# EAGLE design OpenEVSE_PLUS_v3 (EAGLE 7.1.0)
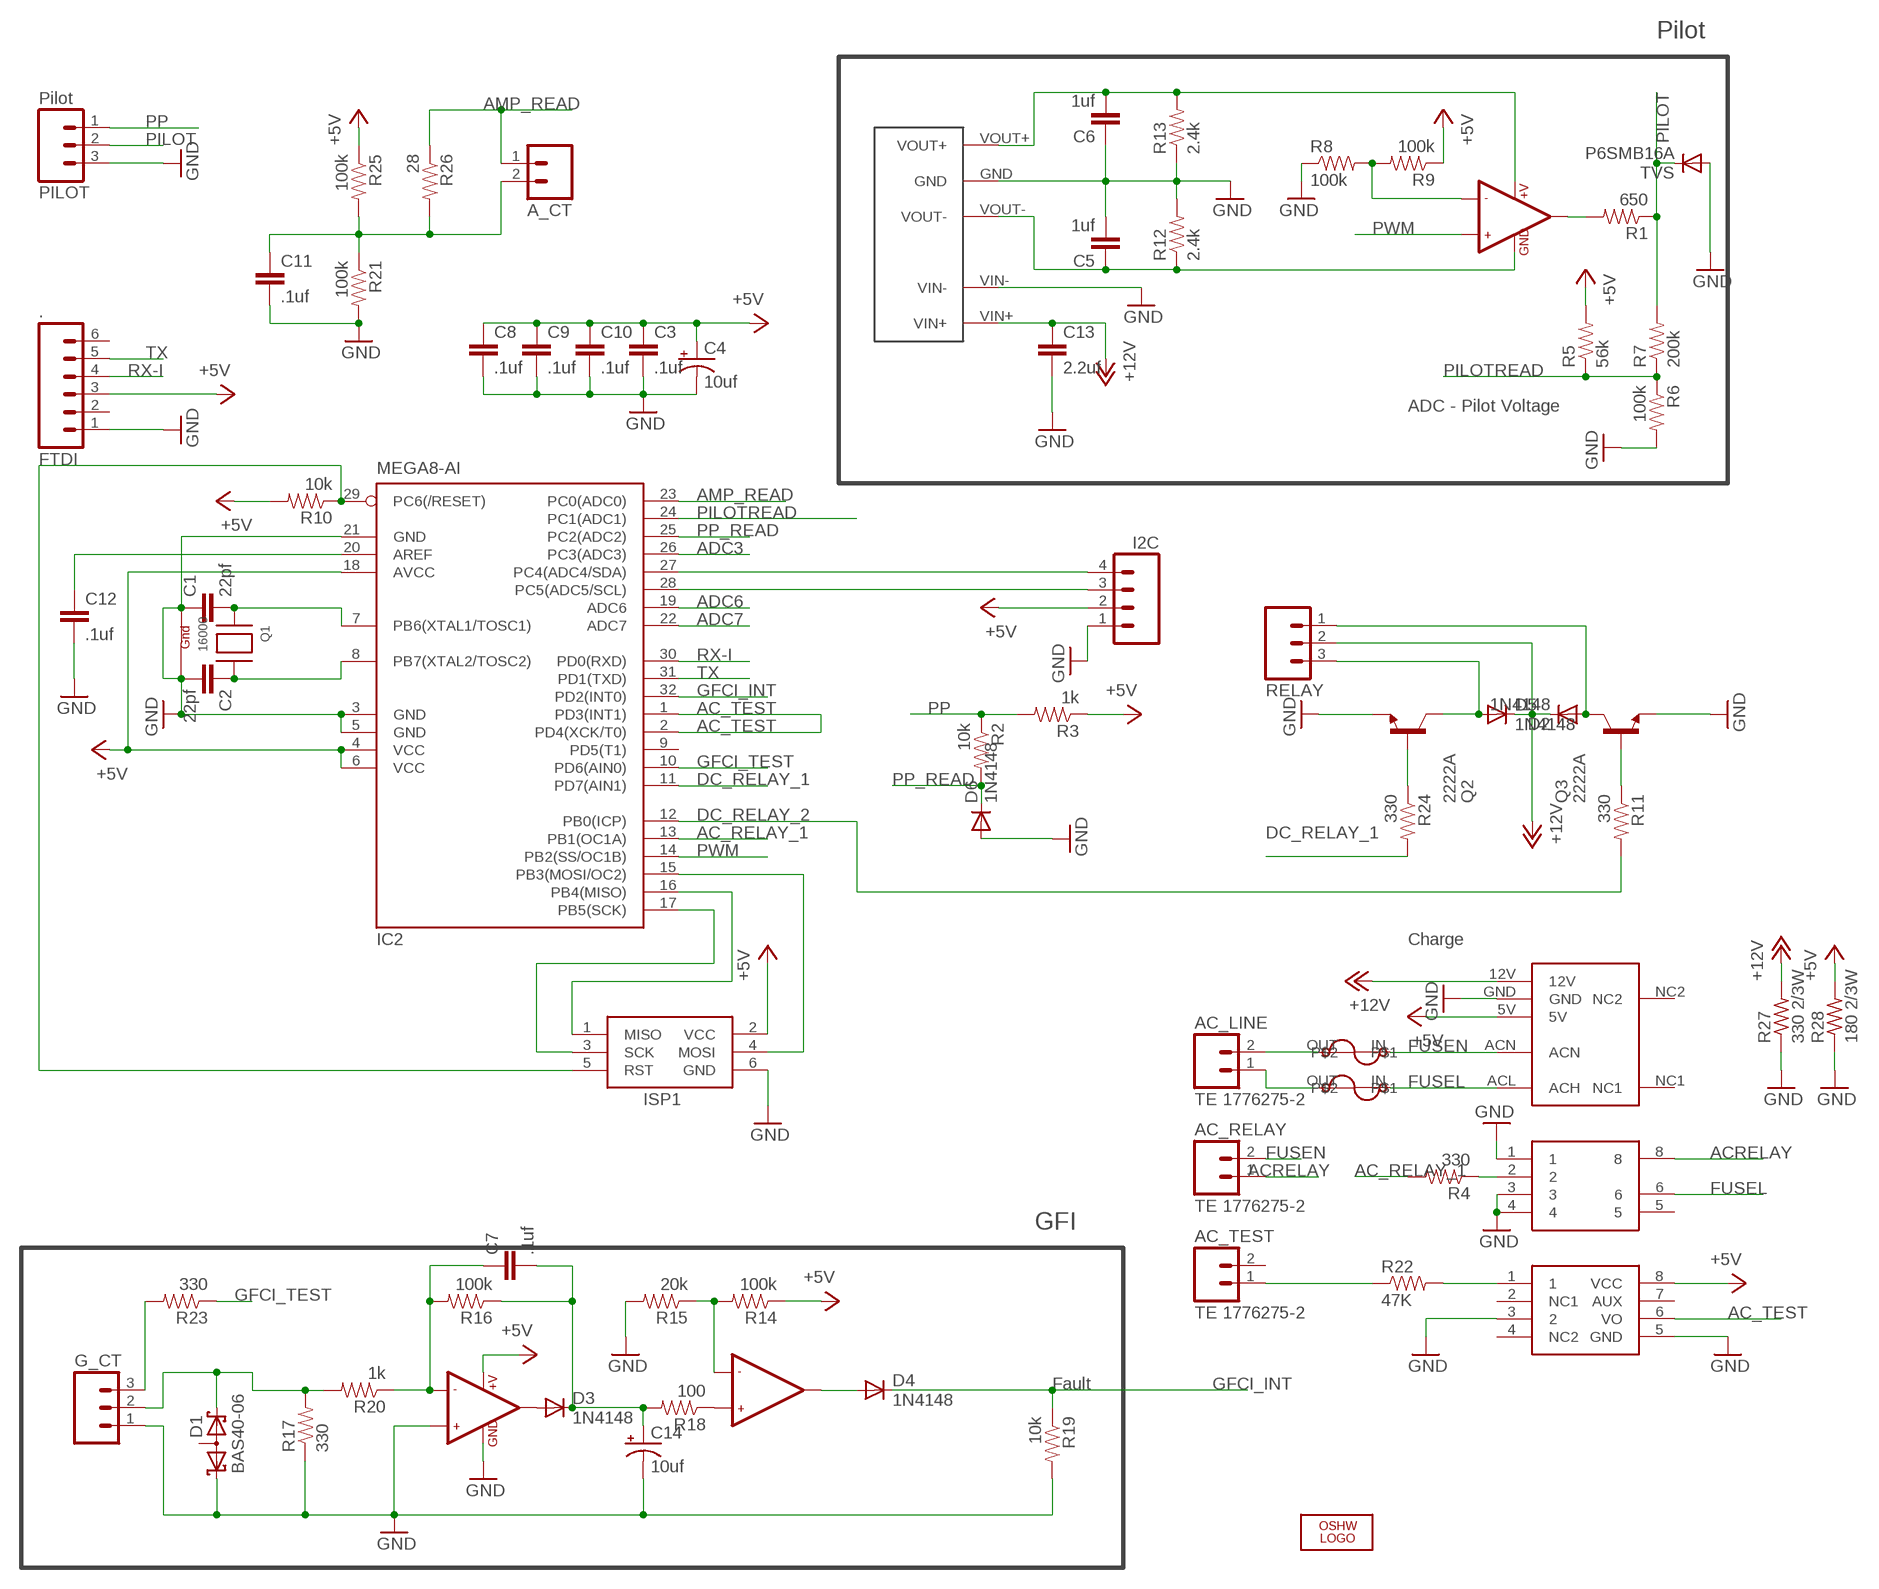
[diagram p0: schematic, sheet 1]

## Parts
.  FTDI  M06LOCK  [1X06_LOCK]
A_CT  M02PTH  [1X02]
AC_LINE  TE 1776275-2  M023.5MM_LOCK  [SCREWTERMINAL-3.5MM-2_LOCK]
AC_RELAY  TE 1776275-2  M023.5MM_LOCK  [SCREWTERMINAL-3.5MM-2_LOCK]
AC_TEST  TE 1776275-2  M023.5MM_LOCK  [SCREWTERMINAL-3.5MM-2_LOCK]
C1  22pf  CAP0805  [0805]
C2  22pf  CAP0805  [0805]
C3  .1uf  CAP0805  [0805]
C4  10uf  CAP_POL1206  [EIA3216]
C5  1uf  CAP0805  [0805]
C6  1uf  CAP0805  [0805]
C7  .1uf  CAP0805  [0805]
C8  .1uf  CAP0805  [0805]
C9  .1uf  CAP0805  [0805]
C10  .1uf  CAP0805  [0805]
C11  .1uf  CAP0805  [0805]
C12  .1uf  CAP0805  [0805]
C13  2.2uf  CAP0805  [0805]
C14  10uf  CAP_POL1206  [EIA3216]
D1  BAS40-06  [SOT23]
D2  1N4148  DIODE-SOD123  [SOD123]
D3  1N4148  DIODE-SOD123  [SOD123]
D4  1N4148  DIODE-SOD123  [SOD123]
D5  1N4148  DIODE-SOD123  [SOD123]
D6  1N4148  DIODE-SOD123  [SOD123]
DCDC  D107E  DCDC_SIP  [DCDC_SIP]
F1  BEL1AFUSE  [BELFUSE1A]
F2  BEL1AFUSE  [BELFUSE1A]
G_CT  M03LOCK  [1X03_LOCK]
I2C  M04LOCK  [1X04_LOCK]
IC2  MEGA8-AI  [TQFP32-08]
IC3  LMV358  [SO08]
IC4  LMV358  [SO08]
IC5  AQH1213  [DIP7]
IC6  MID400  [DIP08]
ISP1  AVRISP-6  [AVRISP]
LOGO1  OSHW_LOGO_8MILX0150-NT  [OSHW_8X150_NOTEXT]
PILOT  Pilot  M03SCREW_LOCK  [SCREWTERMINAL-3.5MM-3_LOCK.007S]
Q1  16000  XTAL-4-3225  [NX3225]
Q2  2222A  BCX70SMD  [SOT23]
Q3  2222A  BCX70SMD  [SOT23]
R1  650  RESISTOR0805-RES  [0805]
R2  10k  RESISTOR0805-RES  [0805]
R3  1k  RESISTOR0805-RES  [0805]
R4  330  RESISTOR0805-RES  [0805]
R5  56k  RESISTOR0805-RES  [0805]
R6  100k  RESISTOR0805-RES  [0805]
R7  200k  RESISTOR0805-RES  [0805]
R8  100k  RESISTOR0805-RES  [0805]
R9  100k  RESISTOR0805-RES  [0805]
R10  10k  RESISTOR0805-RES  [0805]
R11  330  RESISTOR0805-RES  [0805]
R12  2.4k  RESISTOR0805-RES  [0805]
R13  2.4k  RESISTOR0805-RES  [0805]
R14  100k  RESISTOR0805-RES  [0805]
R15  20k  RESISTOR0805-RES  [0805]
R16  100k  RESISTOR0805-RES  [0805]
R17  330  RESISTOR0805-RES  [0805]
R18  100  RESISTOR0805-RES  [0805]
R19  10k  RESISTOR0805-RES  [0805]
R20  1k  RESISTOR0805-RES  [0805]
R21  100k  RESISTOR0805-RES  [0805]
R22  47K  RESISTORPTH-1/4W  [AXIAL-0.4]
R23  330  RESISTOR0805-RES  [0805]
R24  330  RESISTOR0805-RES  [0805]
R25  100k  RESISTOR0805-RES  [0805]
R26  28  RESISTOR0805-RES  [0805]
R27  330 2/3W  R-US_R1206  [R1206]
R28  180 2/3W  R-US_R1206  [R1206]
RELAY  M03SCREW_LOCK  [SCREWTERMINAL-3.5MM-3_LOCK.007S]
TVS  P6SMB16A  DIODE-SMB  [SMB]
U$1  MPM-04E-1205  [MPM-04E-1205]

## Nets
12V: C6.2 DCDC.VOUT+ IC4.8(+V) R13.2
+5V: ..3 C3.1 C4.A(+) C8.1 C9.1 C10.1 I2C.2 IC2.4(VCC) IC2.6(VCC) IC2.18(AVCC) IC3.8(+V) IC6.8(VCC) ISP1.2(VCC) R3.1 R5.2 R9.1 R10.2 R14.1 R25.1 R28.2 U$1.5V
+12V: C13.1 D2.C D5.C DCDC.VIN+ R27.2 RELAY.2 U$1.12V
-12V: C5.1 DCDC.VOUT- IC4.4(GND) R12.1
AC_RELAY_1: IC2.13(PB1(OC1A)) R4.2
AC_TEST: IC2.1(PD3(INT1)) IC2.2(PD4(XCK/T0)) IC6.6(VO)
ACRELAY: AC_RELAY.1 IC5.8
ADC3: IC2.26(PC3(ADC3))
ADC6: IC2.19(ADC6)
ADC7: IC2.22(ADC7)
AMP_READ: A_CT.1 IC2.23(PC0(ADC0)) R26.1
DC_RELAY_1: IC2.11(PD7(AIN1)) R24.2
DC_RELAY_2: IC2.12(PB0(ICP)) R11.2
FUSEL: F2.IN IC5.6 U$1.ACL(ACH)
FUSEN: AC_RELAY.2 F1.IN U$1.ACN
GFCI_INT: D4.C IC2.32(PD2(INT0)) R19.1
GFCI_TEST: IC2.10(PD6(AIN0)) R23.1
GND: ..1 C1.1 C2.2 C3.2 C4.C(-) C5.2 C6.1 C8.2 C9.2 C10.2 C11.2 C12.2 C13.2 C14.C(-) D1.1(K1) D6.A DCDC.GND DCDC.VIN- G_CT.1 I2C.1 IC2.3(GND) IC2.5(GND) IC2.21(GND) IC3.3(+IN1) IC3.4(GND) IC5.1 IC5.3 IC5.4 IC6.3 IC6.5(GND) ISP1.6(GND) PILOT.3 Q1.1(G1) Q1.3(G2) Q2.2(E) Q3.2(E) R6.2 R8.1 R12.2 R13.1 R15.2 R17.1 R19.2 R21.2 R27.1 R28.1 TVS.A U$1.GND
N$1: D2.A Q3.3(C) RELAY.1
N$2: Q3.1(B) R11.1
N$4: C1.2 IC2.7(PB6(XTAL1/TOSC1)) Q1.2(X1)
N$5: C2.1 IC2.8(PB7(XTAL2/TOSC2)) Q1.4(X2)
N$6: D5.A Q2.3(C) RELAY.3
N$7: A_CT.2 C11.1 R21.1 R25.2 R26.2
N$8: C7.1 IC3.2(-IN1) R16.2 R20.1
N$10: IC4.2(-IN1) R8.2 R9.2
N$11: IC4.1(OUT1) R1.2
N$12: AC_LINE.1 F2.OUT
N$13: AC_LINE.2 F1.OUT
N$14: IC2.15(PB3(MOSI/OC2)) ISP1.4(MOSI)
N$15: IC2.17(PB5(SCK)) ISP1.3(SCK)
N$16: IC2.16(PB4(MISO)) ISP1.1(MISO)
N$18: IC5.2 R4.1
N$19: IC6.1 R22.P$2
N$20: D1.2(K2) G_CT.2 R17.2 R20.2
N$21: D3.A IC3.1(OUT1)
N$22: G_CT.3 R23.2
N$23: C7.2 C14.A(+) D3.C R16.1 R18.2
N$24: IC3.6(-IN2) R14.2 R15.1
N$25: D4.A IC3.7(OUT2)
N$26: IC3.5(+IN2) R18.1
N$29: AC_TEST.1 R22.P$1
N$30: Q2.1(B) R24.1
N$39: I2C.4 IC2.27(PC4(ADC4/SDA))
N$40: I2C.3 IC2.28(PC5(ADC5/SCL))
N$44: C12.1 IC2.20(AREF)
PILOT: PILOT.2 R1.1 R7.2 TVS.C
PILOTREAD: IC2.24(PC1(ADC1)) R5.1 R6.1 R7.1
PP: PILOT.1 R2.1 R3.2
PP_READ: D6.C IC2.25(PC2(ADC2)) R2.2
PWM: IC2.14(PB2(SS/OC1B)) IC4.3(+IN1)
RST: IC2.29(PC6(/RESET)) ISP1.5(RST) R10.1
RX-I: ..4 IC2.30(PD0(RXD))
TX: ..5 IC2.31(PD1(TXD))
Unconnected: ..2 ..6 AC_TEST.2 D1.3(AA) IC2.9(PD5(T1)) IC4.5(+IN2) IC4.6(-IN2) IC4.7(OUT2) IC5.5 IC6.2(NC1) IC6.4(NC2) IC6.7(AUX) U$1.NC1 U$1.NC2

## Notes on the sheet
- Pilot
- ADC - Pilot Voltage
- Charge
- GFI
- Fault

## Library data of the parts
. = SparkFun:M06: Header 6 Standard 6-pin 0.1" header. Use with straight break away headers (SKU : PRT-00116), right angle break away headers (PRT-00553), swiss pins (PRT-00743), machine pins (PRT-00117), and female headers (PRT-00115). Molex polarized connector foot print use with SKU : PRT-08094 with associated crimp pins and housings. NOTES ON THE VARIANTS LOCK and LOCK_LONGPADS... This footprint was designed to help hold the alignment of a through-hole component (i.e. 6-pin header) while soldering it into place. You may notice that each hole has been shifted either up or down by 0.005 of an inch from it's more standard position (which is a perfectly straight line). This slight alteration caused the pins (the squares in the middle) to touch the edges of the holes. Because they are alternating, it causes a "brace" to hold the component in place. 0.005 has proven to be the perfect amount of "off-center" position when using our standard breakaway headers. Although looks a little odd when you look at the bare footprint, once you have a header in there, the alteration is very hard to notice. Also, if you push a header all the way into place, it is covered up entirely on the bottom side. This idea of altering the position of holes to aid alignment will be further integrated into the Sparkfun Library for other footprints. It can help hold any component with 3 or more connection pins.
A_CT AC_LINE AC_RELAY AC_TEST = SparkFun:M02: Header 2 Standard 2-pin 0.1" header. Use with straight break away headers (SKU : PRT-00116), right angle break away headers (PRT-00553), swiss pins (PRT-00743), machine pins (PRT-00117), and female headers (PRT-00115). Molex polarized connector foot print use with SKU : PRT-08233 with associated crimp pins and housings.
C1-C3 C5-C13 = SparkFun:CAP: Capacitor Standard 0603 ceramic capacitor, and 0.1" leaded capacitor.
C4 C14 = SparkFun:CAP_POL: Capacitor Polarized These are standard SMD and PTH capacitors. Normally 10uF, 47uF, and 100uF in electrolytic and tantalum varieties. Always verify the external diameter of the through hole cap, it varies with capacity, voltage, and manufacturer. The EIA devices should be standard.
D1 = diode:BAS40-06: Silicon Schottky Diodes General-purpose diode for high-speed switching
D2-D6 TVS = diode:DIODE-: DIODE
DCDC = Qxd:DCDC_SIP
F1 F2 = Qxd:BEL1AFUSE
G_CT PILOT RELAY = SparkFun:M03: Header 3 Standard 3-pin 0.1" header. Use with straight break away headers (SKU : PRT-00116), right angle break away headers (PRT-00553), swiss pins (PRT-00743), machine pins (PRT-00117), and female headers (PRT-00115). Molex polarized connector foot print use with SKU : PRT-08232 with associated crimp pins and housings.
I2C = SparkFun:M04: Header 4 Standard 4-pin 0.1" header. Use with straight break away headers (SKU : PRT-00116), right angle break away headers (PRT-00553), swiss pins (PRT-00743), machine pins (PRT-00117), and female headers (PRT-00115). Molex polarized connector foot print use with SKU : PRT-08231 with associated crimp pins and housings.
IC2 = atmel:MEGA8: MICROCONTROLLER 8 Kbytes FLASH, 1 kbytes SRAM, 512 bytes EEPROM, USART, 6-channel 10 bit ADC, 2-channel 8 bit ADC Pin compatible with Atmega48, ATMega88, ATMega168 Source: avr.lbr; MPN: ATMEGA8-16AU; OC_FARNELL: 9171371; OC_NEWARK: 73M8863
IC3 IC4 = SparkFun:LMV358
IC5 = SparkFun:AQH1213
IC6 = SparkFun:MID400
ISP1 = adafruit:AVRISP: AVR ISP HEADER Standard 6 pin header for AVR programming
LOGO1 = ohw-logo:OSHW_LOGO_8MIL
Q1 = adafruit:XTAL-4: Classic 4-pin 3.2 x 2.5mm crystal
Q2 Q3 = transistor-npn:BCX70*: NPN Transistor
R1-R26 = SparkFun:RESISTOR: Resistor Basic schematic elements and footprints for 0603, 1206, and PTH resistors.
R27 R28 = rcl:R-US_: RESISTOR, American symbol
U$1 = Qxd:MPM-04E-1205

## Board
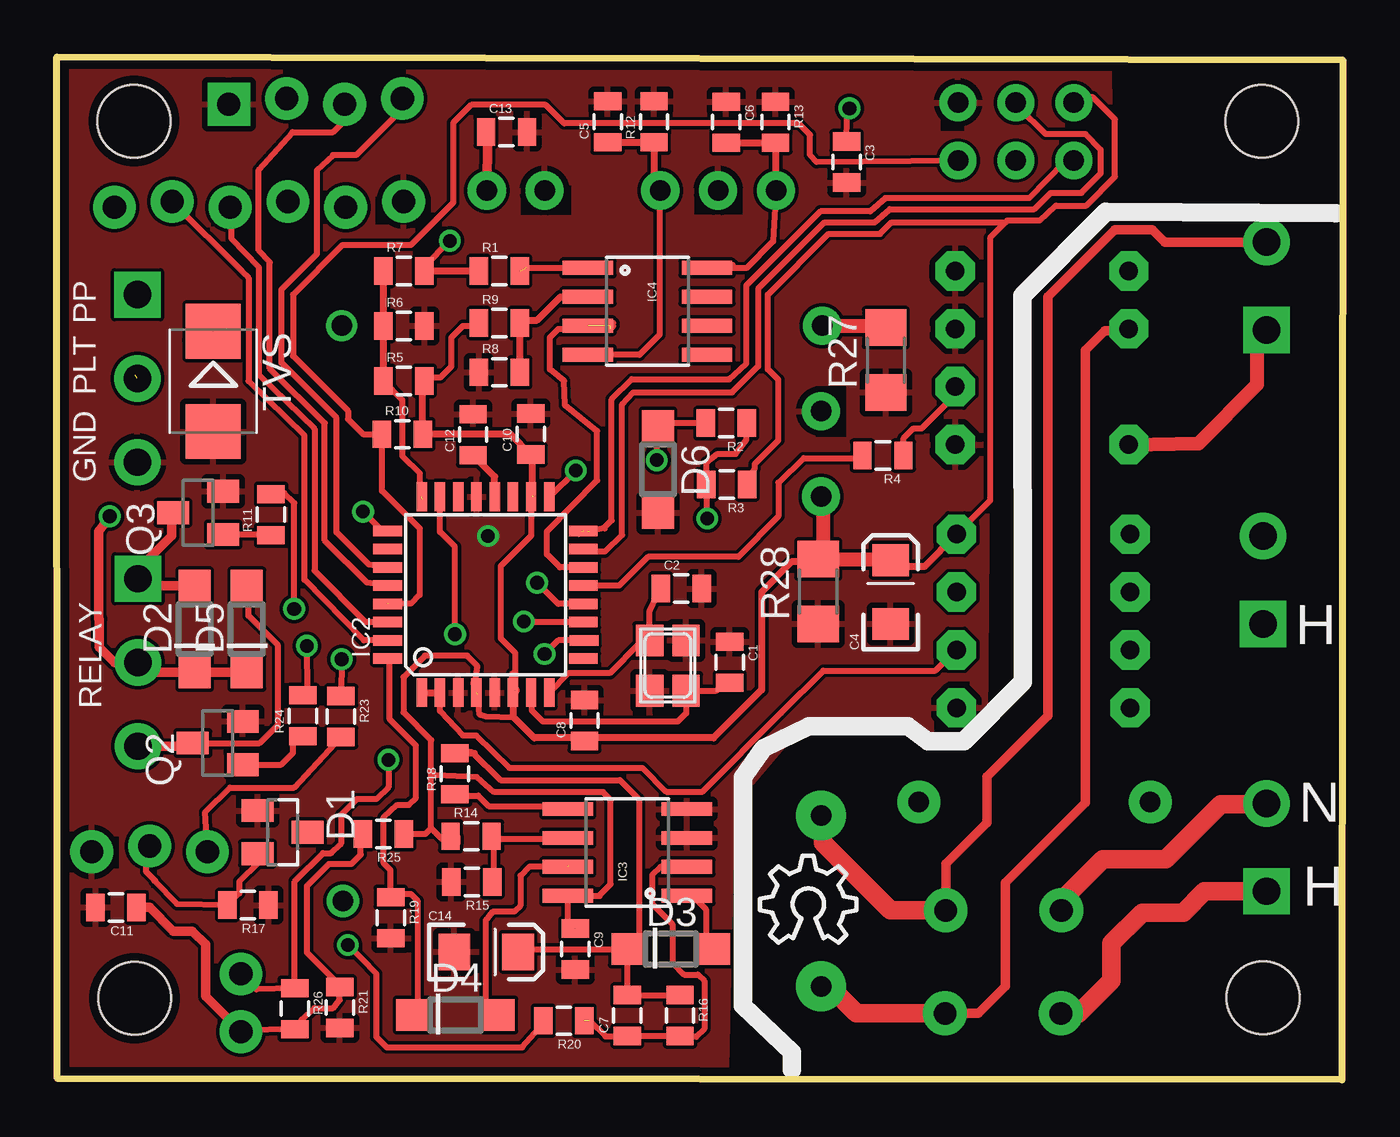
[diagram p1: board, top side]
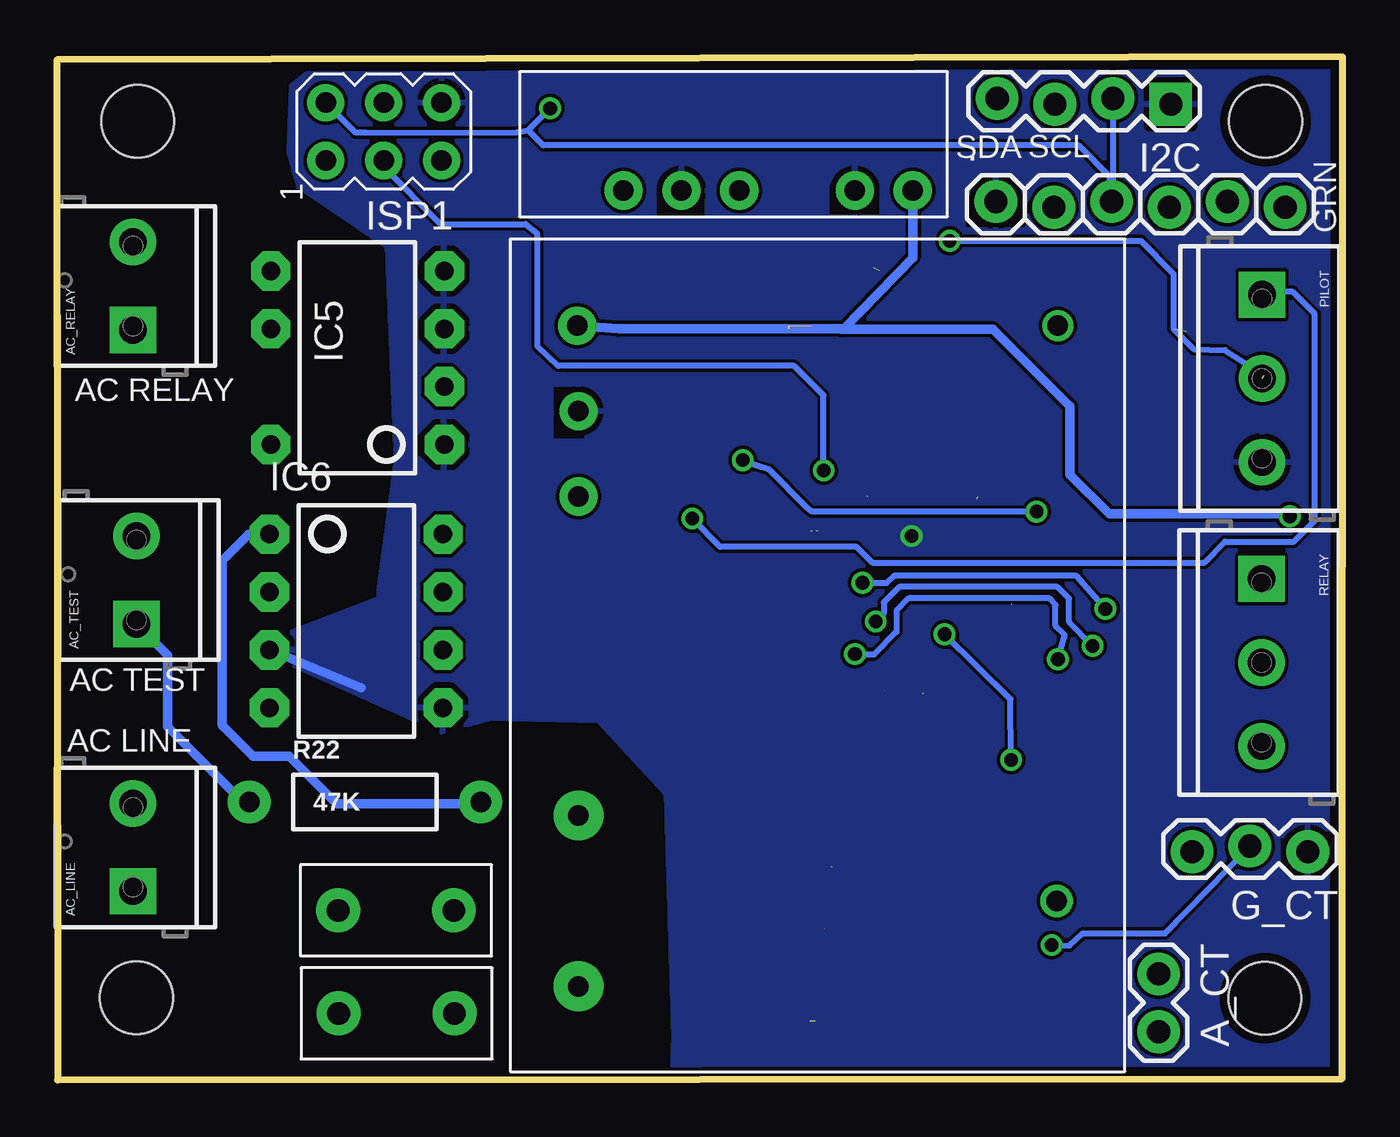
[diagram p2: board, bottom side, seen from below]

Size 56.46 x 44.9 mm. Coordinates in mm from the lower left corner, seen from the top.
Outline: 56.46,44.77 56.43,0 0.02,0.05 0,44.9 56.46,44.77
Copper layers (1*16): Top 0.0356mm / dielectric 1.5011mm / Bottom 0.0356mm
Design rules "default": minimum track width 6mil, minimum drill 13mil, track to track 6mil, track to pad 6mil, pad to pad 6mil, via to via 6mil, smd to smd 6mil, copper to edge 15mil, drill to drill 6mil, minimum pad ring 7mil, minimum via ring 7mil, stop-mask expansion 4mil, vias tented up to drill 0mil, thermal gap 10mil
Holes 3.2 mm at 52.91,42.08 52.97,3.6 3.41,3.58 3.38,42.09
tRestrict: area 38.8,41.7 to 39.8,42.4; area 3.2,25.9 to 3.9,28.3; area 7.2,41.6 to 7.9,44; area 38.3,35.2 to 40.5,35.8; area 39.2,43.2 to 40,43.9; area 38.4,32.6 to 40.5,33.3; area 38.4,27.5 to 39.3,28.3; area 39.1,16.2 to 39.8,17; area 39.1,16.9 to 40.1,17.5; area 1.8,9.3 to 2.7,10.7; area 14,37.6 to 16.4,38.8; area 20.4,38 to 22.6,39.2; 2 more areas
bRestrict: area 39.1,41.6 to 40.1,42.4; area 3.2,25.9 to 3.9,28.3; area 7.2,41.6 to 7.9,44; area 38.3,35.2 to 40.6,35.8; area 39.3,43.4 to 40,43.8; area 38.4,32.5 to 40.6,33.3; area 38.4,27.4 to 40.6,28.3; area 39.2,16.6 to 39.9,17.4; area 1.8,9.4 to 2.7,10.6; area 13.9,37.4 to 16.5,38.7; area 20.4,38 to 22.5,39.3; area 28,37.9 to 30.1,39.3; 1 more areas

### Footprints (pad centres in the part's own frame; a part is rotated, then mirrored left to right if it is on the bottom)
1X06_LOCK = drill 1.016 pad 1.88: 1 0,0; 2 2.54,-0.254; 3 5.08,0; 4 7.62,-0.254; 5 10.16,0; 6 12.7,-0.254
1X02 = drill 1.016 pad 1.88: 1 0,0; 2 2.54,0
SCREWTERMINAL-3.5MM-2_LOCK = drill 1.2 pad 2.032 square: 1 -0.178,0 | drill 1.2 pad 2.032: 2 3.678,0
0805 = smd 0.8 x 1.2: 1 -0.9,0; 2 0.9,0
EIA3216 = smd 1.4 x 1.6: A 1.4,0; C -1.4,0
SOT23 = smd 1 x 1.4: 1 -0.95,-1.1; 2 0.95,-1.1; 3 0,1.1
SOD123 = smd 1.4 x 1.4: A 1.9,0; C -1.9,0
DCDC_SIP = drill 0.9 pad 1.676: GND 10.16,0; VIN+ 0,0; VIN- 2.54,0; VOUT+ 12.7,0; VOUT- 7.62,0
BELFUSE1A = drill 1 pad 1.93: IN 2,1.66; OUT 2,6.74
1X03_LOCK = drill 1.016 pad 1.88: 1 0,0.127; 2 2.54,-0.127; 3 5.08,0.127
1X04_LOCK = drill 1.016 pad 1.88 square: 1 0,0.127 | drill 1.016 pad 1.88: 2 2.54,-0.127; 3 5.08,0.127; 4 7.62,-0.127
TQFP32-08 = smd 1.27 x 0.457: 1 -4.293,2.8; 2 -4.293,2; 3 -4.293,1.2; 4 -4.293,0.4; 5 -4.293,-0.4; 6 -4.293,-1.2; 7 -4.293,-2; 8 -4.293,-2.8; 17 4.293,-2.8; 18 4.293,-2; 19 4.293,-1.2; 20 4.293,-0.4; 21 4.293,0.4; 22 4.293,1.2; 23 4.293,2; 24 4.293,2.8 | smd 0.457 x 1.27: 9 -2.8,-4.293; 10 -2,-4.318; 11 -1.2,-4.293; 12 -0.4,-4.293; 13 0.4,-4.293; 14 1.2,-4.293; 15 2,-4.293; 16 2.8,-4.293; 25 2.8,4.293; 26 2,4.293; 27 1.2,4.293; 28 0.4,4.293; 29 -0.4,4.293; 30 -1.2,4.293; 31 -2,4.293; 32 -2.8,4.293
SO08 = smd 0.61 x 2.21: 1 -1.905,-2.616; 2 -0.635,-2.616; 3 0.635,-2.616; 4 1.905,-2.616; 5 1.905,2.616; 6 0.635,2.616; 7 -0.635,2.616; 8 -1.905,2.616
DIP7 = drill 0.813 pad 1.727 octagon: 1 -3.81,-3.81; 2 -1.27,-3.81; 3 1.27,-3.81; 4 3.81,-3.81; 5 3.81,3.81; 6 1.27,3.81; 8 -3.81,3.81
DIP08 = drill 0.813 pad 1.727 octagon: 1 -3.81,-3.81; 2 -1.27,-3.81; 3 1.27,-3.81; 4 3.81,-3.81; 5 3.81,3.81; 6 1.27,3.81; 7 -1.27,3.81; 8 -3.81,3.81
AVRISP = drill 0.9 pad 1.626: 1 -1.27,2.54; 2 1.27,2.54; 3 -1.27,0; 4 1.27,0; 5 -1.27,-2.54; 6 1.27,-2.54
SCREWTERMINAL-3.5MM-3_LOCK.007S = drill 1.2 pad 2.032 square: 1 -0.178,0 | drill 1.2 pad 2.032: 2 3.5,0; 3 7.178,0
NX3225 = smd 1.4 x 1.2: 1 -1.1,0.8; 2 1.1,0.8; 3 1.1,-0.8; 4 -1.1,-0.8
AXIAL-0.4 = drill 0.9 pad 1.88: P$1 -5.08,0; P$2 5.08,0
R1206 = smd 1.6 x 1.803: 1 -1.422,0; 2 1.422,0
SMB = smd 2.4 x 2.4: A 2.2,0; C -2.2,0
MPM-04E-1205 = drill 0.9 pad 1.676: 5V 3,25.25; 12V 2.95,32.75; GND 3,29 | drill 0.9 pad 2.184: ACL 3,3.75; ACN 3,11.25 | drill 0.9 pad 1.422: NC1 24,7.5 | drill 0.9: NC2 24.05,32.75

### Placement (x,y rotation side)
.  15.22,38.56 0 bottom
A_CT  8.08,4.65 270 bottom
AC_LINE  53.12,8.46 90 bottom
AC_RELAY  53.12,33.1 90 bottom
AC_TEST  52.96,20.19 90 bottom
C1  29.55,18.33 270 top
C2  27.42,21.56 0 top
C3  34.68,40.29 270 top
C4  36.61,21.41 90 top
C5  24.19,42.06 90 top
C6  29.39,42.04 270 top
C7  25.05,2.82 90 top
C8  23.17,15.77 90 top
C9  22.76,5.74 270 top
C10  20.81,28.35 90 top
C11  2.6,7.57 180 top
C12  18.28,28.32 90 top
C13  19.74,41.61 0 top
C14  18.85,5.61 0 top
D1  9.91,10.87 270 top
D2  6.05,19.79 90 top
D3  26.95,5.74 0 top
D4  17.51,2.84 0 top
D5  8.34,19.79 90 top
D6  26.4,26.8 270 top
DCDC  18.88,39.04 180 bottom
F1  37.37,5.44 90 bottom
F2  37.34,0.91 90 bottom
G_CT  1.53,10.13 180 bottom
I2C  7.55,42.95 180 bottom
IC2  18.82,21.29 90 top
IC3  25.05,9.98 90 top
IC4  25.93,33.74 270 top
IC5  43.26,31.7 90 bottom
IC6  43.31,20.14 270 bottom
ISP1  42.11,41.63 90 bottom
LOGO1  30.87,6.02 0 top
PILOT  3.54,34.29 270 bottom
Q1  26.83,18.19 270 top
Q2  7.07,14.78 90 top
Q3  6.2,24.89 90 top
R1  19.43,35.51 0 top
R2  29.39,28.83 180 top
R3  29.42,26.14 180 top
R4  36.28,27.41 180 top
R5  15.24,30.68 0 top
R6  15.24,33.1 0 top
R7  15.24,35.51 0 top
R8  19.43,31.06 0 top
R9  19.43,33.22 0 top
R10  15.17,28.34 0 top
R11  9.4,24.81 90 top
R12  26.22,42.06 90 top
R13  31.55,42.04 270 top
R14  18.19,10.69 0 top
R15  18.22,8.69 180 top
R16  27.36,2.82 270 top
R17  8.39,7.67 180 top
R18  17.48,13.44 90 top
R19  14.66,7.11 270 top
R20  22.26,2.59 180 top
R21  12.43,3.18 270 top
R22  42.93,12.19 0 bottom
R23  12.48,15.95 270 top
R24  10.8,15.98 90 top
R25  14.33,10.79 180 top
R26  10.44,3.12 270 top
R27  36.4,31.6 90 top
R28  33.43,21.44 90 top
RELAY  3.56,21.82 270 bottom
TVS  6.86,30.66 270 top
U$1  36.56,0.36 0 bottom

### Tracks (layer width: path | path; a pad name or v marks a point on that pad's centre or on a via)
12V
  Top 0.254: 29.68,35.76 IC4.8 28.81,35.64 30.28,35.64 31.45,36.8 DCDC.VOUT+ | 31.58,41.12 31.49,41.2 R13.2
  Top 0.305: DCDC.VOUT+ 31.58,41.12 31.42,41.22 | C6.2 R13.2
+5V  (via drill 0.6)  (4 unrouted)
  Top 0.254: R5.2 16.14,30.83 16.84,30.83 17.33,31.32 17.33,32.59 17.84,33.1 18.6,33.1 18.6,33.16 R9.1 | 20.88,25.65 IC2.18 20.82,23.89 19.49,22.56 19.49,19.38 20.12,18.75 20.12,16.9 | 17.52,10.4 R14.1 17.32,10.54 16.92,10.57 16.44,11.05 | C9.1 22.43,6.96 IC3.8 23.83,8.08 23.83,8.1 24.31,8.59 24.31,12.29 23.98,12.62 19.21,12.62 18.45,13.28 16.62,13.36 16.51,13.46 | 20.12,16.59 20.12,16.9 | 20.12,16.9 IC2.6 | 44.4,42.55 44.4,42.63 ISP1.2 44.88,43.13 45.5,43.13 46.46,42.16 46.46,39.65 45.22,38.38 43.87,38.38 43.16,37.72 41.74,37.72 41.66,37.64 | C3.1 34.7,42.24 v34.8,42.65 | 16.51,13.46 16.44,13.54 | 16.44,13.39 16.44,14.91 15.22,16.13 15.22,17.68 16.16,18.62 18.01,18.62 18.47,18.16 18.37,17.42 | 16.44,11.05 16.44,13.39 | 16.44,13.39 16.51,13.46 | R25.1 16.18,10.8 16.44,11.05 | 19.99,16.97 19.99,17.83 | 41.66,37.64 40.98,36.96 40.98,25.43 IC6.8 | 30.28,26.31 R3.1 30.64,26.84 30.64,27.03 31.68,28.07 31.68,30.73 31.22,31.19 31.22,34.47 33.89,37.14 36.15,37.14 36.66,37.64 41.66,37.64 | 18.45,16.92 18.55,16.05 18.83,15.95 20.05,15.93 | C8.1 23.17,14.94 23.25,15.01
  Top 0.305: 20.07,16.96 IC2.6 20.05,16.98 20.05,15.93 20.96,15.01 23.25,15.01 28.83,15.01 30.94,17.12 30.94,21.41 32.29,22.76 33.33,22.76 R28.2 | 44.4,43.05 44.4,42.55 | R5.2 16.07,30.61 R10.2 19.91,28.34 C10.1 20.88,27.37 20.88,25.6 | IC6.8 38.09,22.52 36.72,22.52 C4.A
  Top 0.406: IC2.6 20.12,17.1 | 20.12,17.09 19.99,16.97 | 18.45,16.92 18.37,17.42 | 17.52,10.4 17.52,10.66
  Top 0.61: U$1.5V 33.64,25.78 33.64,23.07 R28.2 36.39,22.86 C4.A
  Bottom 0.254: 10.22,38.43 10.22,38.49 | 10.22,38.49 ..3 10.09,38.61 I2C.2 | 35.77,41.68 36.25,41.61 42.91,41.58 43.33,41.58 ISP1.2 | 35.77,41.68 v34.8,42.65 | 10.22,38.49 10.22,39.65 11.59,41.02 35.11,41.02 35.77,41.68
  Bottom 0.305: ..3 10.14,39.5
+12V  (via drill 0.6)
  Top 0.254: C13.1 18.84,41.52 18.93,41.38
  Top 0.406: DCDC.VIN+ 18.93,41.38 18.75,41.76 18.85,41.86 | v2.32,24.74 1.86,24.1 1.83,24.08 1.83,20.24 1.86,20.22 1.86,19 2.54,18.32 RELAY.2 3.99,17.89 D2.C D5.C
  Top 0.61: U$1.12V 35.91,33.11 R27.2
  Bottom 0.406: DCDC.VIN+ 18.88,36.09 21.9,32.97 22.05,32.97 | 22.05,32.97 31.79,32.97 U$1.12V | v2.32,24.74 2.6,24.84 10.24,24.84 11.97,26.57 11.97,29.57 15.35,32.94 22.03,32.94 22.05,32.97
-12V
  Top 0.254: 26.47,38.94 26.47,32.72 25.58,31.83 23.58,31.83 IC4.4 | 26.15,41.16 R12.1
  Top 0.305: C5.1 26.15,41.16 26.22,41.22 R12.1 26.22,39.19 26.32,39.09 DCDC.VOUT- 26.47,38.94
AC_RELAY_1
  Top 0.254: IC2.13 24.69,21.69 25.96,22.96 29.93,22.96 31.68,24.74 31.68,26.21 32.79,27.29 35.26,27.29 R4.2
AC_TEST
  Top 0.254: IC2.2 16.82,16.18 17.84,15.11 18.42,15.11 19.87,13.69 25.71,13.69 26.75,12.65 28.35,12.65 31.81,16.1 33.66,17.96 38.59,17.96 IC6.6
  Top 0.305: 16.79,16.96 IC2.2 IC2.1
ACRELAY
  Top 0.61: IC5.8 50.15,27.94 52.71,30.53 52.71,32.97 AC_RELAY.1
  Top 1.016: 52.76,32.97 AC_RELAY.1
AMP_READ  (via drill 0.6)
  Top 0.254: A_CT.1 8.76,3.97 R26.1 10.45,8.71 11.69,9.96 12.04,9.96 12.45,10.34 12.48,10.36 12.48,11.63 13.16,12.32 14.03,12.32 14.56,12.85 v14.56,14.05 | v17.48,19.56 17.48,23.39 16.82,24.05 IC2.23
  Bottom 0.254: v14.56,14.05 14.59,16.71 v17.48,19.56
DC_RELAY_1  (via drill 0.6)
  Top 0.254: IC2.11 20.53,20.09 v20.5,20.12 | R24.2 11,17.02 v10.98,19.05
  Bottom 0.254: v10.98,19.05 12.02,20.12 12.02,21.13 12.53,21.64 19.46,21.64 20.15,20.96 20.15,20.47 v20.5,20.12
DC_RELAY_2  (via drill 0.6)
  Top 0.254: IC2.12 22.01,20.89 v21.09,21.82 | v10.42,20.68 10.42,25.32 9.99,25.76 9.45,25.76 R11.2
  Bottom 0.254: v10.42,20.68 11.71,22.15 19.66,22.15 20.02,21.82 v21.09,21.82
FUSEL
  Top 0.406: F2.IN 40.46,2.91 41.66,4.12 41.66,8.66 45.17,12.17 45.17,32.03 46.03,32.89 47,32.89 IC5.6
  Top 0.813: U$1.ACL 33.92,4.11 35.11,2.92 F2.IN
FUSEN
  Top 0.406: AC_RELAY.2 48.65,36.77 48.11,37.31 46.46,37.31 43.52,34.37 43.52,15.98 40.85,13.31 40.85,11.28 39.05,9.47 39.05,7.45 F1.IN
  Top 0.813: F1.IN 36.61,7.44 33.64,10.41 33.64,11.35 U$1.ACN
GFCI_INT
  Top 0.254: 16.01,2.84 D4.C 15.83,3.07 15.83,7.87 15.55,8.15 14.8,8.15 R19.1 14.65,9.21 14.36,9.5 14.36,11.53 14.94,12.07 15.45,12.07 15.75,12.37 15.75,14.68 14.61,15.82 14.61,18.41 IC2.32 14.51,18.47
GFCI_TEST  (via drill 0.6)
  Top 0.254: IC2.10 22.02,19.29 v21.42,18.69 | v12.5,18.47 R23.1
  Bottom 0.254: v12.5,18.47 12.2,19.53 12.6,19.94 12.6,20.85 12.88,21.13 19.05,21.13 19.59,20.6 19.59,19.66 20.58,18.67 21.39,18.67 v21.42,18.69
GND  (via drill 0.6)
  Top 0.254: C14.C 17.83,5.21
  Bottom 0.406: IC6.3 43.11,17.22
  other vias: 18.93,23.88
  pour Top: 0.03,45.04 3.28,45.15 46.38,44.92 42.5,38.51 40.92,36.5 40.74,15.72 32.71,16.19 29.64,12.8 29.39,0.47 24.17,0.1 0.06,0.08 -0.04,25.18 0.03,28.79
  pour Bottom: 0.31,45.1 44.88,44.64 46.16,43.61 46.26,40.74 45.83,39.22 41.94,36.6 41.53,27.2 42.17,22.45 42.32,21.29 42.22,21.49 42.19,21.13 47.81,19 39.58,15.29 37.4,15.89 32.68,15.79 29.7,12.55 29.36,1.88 29.44,-0.1 27.13,0.18 23.21,0.21 17.1,0.11 6.75,-0.19 -0.23,0.21
  pour Top: -0.1,45.17 3.16,45.28 45.85,44.77 46.2,44.25 46.26,39.73 38.38,36.27 38.38,15.23 32.84,15.78 29.62,12.02 28.63,0.46 26.14,0.32 24.04,0.23 -0.07,0.21 -0.16,28.23 -0.1,28.91
N$1
  Top 0.406: D2.A 3.87,21.69 RELAY.1 3.56,22.4 5.03,23.88 5.03,24.82 Q3.3
N$2
  Top 0.254: Q3.1 9.37,23.94 R11.1
N$4
  Top 0.254: C1.2 28.94,17.09 Q1.2 27.63,16.09 27.26,15.72 21.34,15.72 20.86,16.21 20.86,16.97 IC2.7
N$5
  Top 0.254: Q1.4 26.03,20.59 26.34,21.29 26.34,21.39 C2.1 | Q1.4 26.12,19.16 | Q1.4 25.62,19.16 25.59,19.16 24.29,17.86 22.48,17.86 IC2.8
N$6
  Top 0.254: Q2.3 8.89,14.78 9.71,15.6 9.71,19.08 8.41,20.37 8.41,20.98 8.73,21.3
  Top 0.305: 8.73,21.3 D5.A
  Top 0.406: RELAY.3 5.82,14.64 Q2.3
N$7
  Top 0.254: R26.2 8.15,2.17 A_CT.2 | 10.45,2.15 R26.2 | R26.2 10.73,2.22 10.73,2.62 11.31,3.15 12.12,3.15 12.43,3.51 R21.1 12.49,4.08 10.98,5.59 10.98,8.51 11.94,9.47 12.93,9.47 13.34,9.88 13.34,10.7 R25.2
  Top 0.406: C11.1 4.07,7.57 5.11,6.53 5.95,6.53 6.53,5.94 6.53,3.66 A_CT.2
N$8  (1 unrouted)
  Top 0.254: R16.2 C7.1 | 27.34,1.8 27.34,1.89 R16.2 | 25.01,1.88 C7.1 | 23.4,2.59 24.08,1.91 25.04,1.91 C7.1 | IC3.2 26.5,9.35 26.14,8.99 26.14,7.72 27.03,6.83 27.03,5.13 27.54,4.62 28.15,4.62 28.43,4.34 28.43,2.24 28.07,1.88 27.4,1.88 R16.2
N$10
  Top 0.305: 20.08,30.68 R8.2 R9.2 20.2,33.35 21.08,33.35 22.11,34.38 IC4.2
N$11  (1 unrouted)
  Top 0.254: 20.59,35.65 IC4.1
N$12
  Top 0.813: AC_LINE.1 50.4,8.28 49.46,7.34 47.66,7.34 46.31,5.99 46.31,4.34 44.86,2.9 44.1,2.9 F2.OUT
N$13
  Top 0.813: F1.OUT 44.11,7.86 45.93,9.68 48.7,9.68 51.11,12.09 53.07,12.09 AC_LINE.2
N$14
  Top 0.254: 41.84,42.67 42.25,42.67 43.41,41.53 45.17,41.53 45.83,40.84 45.83,39.78 44.99,38.94 43.64,38.94 42.93,38.23 36.58,38.23 35.92,37.64 33.71,37.64 30.79,34.72 30.79,31.32 29.65,30.18 25.3,30.18 24.82,29.67 24.82,23.93 24.06,23.19 23.22,23.19 IC2.15 23.14,23.32 | 41.84,42.67 41.74,42.67 | ISP1.4 41.86,42.66 41.84,42.67
N$15  (via drill 0.6)
  Top 0.254: IC2.17 21.63,25.59 v22.79,26.75
  Bottom 0.254: v22.79,26.75 22.79,30.05 24.08,31.34 34.45,31.34 35.36,32.21 35.36,37.14 35.87,37.57 39.6,37.57 42.11,40.07 ISP1.3
N$16  (2 unrouted)
  Top 0.254: IC2.16 23.24,24.21 23.37,24.08 | 23.04,24.08 22.92,23.95 | 23.3,24.08 24.06,24.21 24.06,24.26 24.36,24.56 24.36,29.87 25.25,30.76 29.49,30.76 29.52,30.73 30.28,31.45 30.28,34.87 33.53,38.13 35.72,38.13 36.38,38.71 42.7,38.71 44.25,40.28 ISP1.1
N$18
  Top 0.254: R4.1 37.18,28.15 37.62,28.6 37.98,28.6 39.15,29.77 39.15,30.12 IC5.2
N$19
  Bottom 0.406: IC6.1 48.04,23.95 49.21,22.78 49.21,15.57 47.83,14.2 46.26,14.2 44.18,12.12 37.93,12.12 R22.P$2
N$20  (via drill 0.6)
  Top 0.254: G_CT.2 3.92,10.24 3.92,9.14 4.32,8.74 4.27,8.74 5.27,7.71 R17.2 8.01,8.19 8.01,8.71 8.81,9.52 D1.2 | R20.2 21.36,2.45 20.43,1.42 14.48,1.42 14.03,1.88 14.03,4.65 v12.78,5.92
  Bottom 0.254: G_CT.2 7.8,6.43 11.41,6.43 11.99,5.89 v12.78,5.92
N$21
  Top 0.254: IC3.1 27.92,8.08 28.5,7.49 28.5,6.09 D3.A
N$22
  Top 0.254: G_CT.3 6.51,11.74 7.6,12.83 10.41,12.83 R23.2
N$23
  Top 0.254: 27.34,3.96 27.59,3.71 27.59,3.58 27.45,3.72 R16.1 C7.2 25.05,5.36 D3.C | 18.36,14.34 R18.2 17.39,14.34 17.35,14.38 | C14.A 20.35,5.61 20.48,5.74 24.92,5.74 | 24.92,5.74 25.05,5.61 | 24.92,5.74 D3.C | D3.C 24.93,5.61 24.92,5.61 25.56,5.99 25.56,12.32 24.72,13.16 19.49,13.16 18.24,14.38 18.06,14.38 17.94,14.25 17.81,14.38 17.35,14.38 | 17.35,14.38 17.3,14.38
N$24
  Top 0.254: 19.21,8.37 19.21,8.66 | 19.21,8.66 19.21,10.48 R14.2 19.26,10.59 22.31,10.59 IC3.6 | R15.1 19.18,8.69 19.21,8.66
  Top 0.406: R14.2 19.23,10.59 19.21,10.57
N$25  (1 unrouted)
  Top 0.254: D4.A 18.83,3.37 18.83,6.99 19.16,7.39 20.1,7.39 20.35,7.65 20.35,8.97 20.76,9.37 22.46,9.37
N$26
  Top 0.254: IC3.5 22.31,12.01 18.95,12.01 18.5,12.47 17.55,12.47 R18.1
N$29
  Bottom 0.406: R22.P$1 48.29,12.19 51.59,15.49 51.59,18.64 AC_TEST.1
N$30
  Top 0.254: Q2.1 9.85,13.83 10.37,14.35 10.37,14.98 R24.1
N$39
  Top 0.254: IC2.27 13.71,22.62 12.27,24.03 12.27,29.06 9.86,31.47 9.86,34.7 11.41,36.25 11.41,39.93 12.12,40.59 13.14,40.59 15.3,42.75 I2C.4
N$40
  Top 0.254: IC2.28 13.62,21.82 11.77,23.67 11.77,28.83 9.35,31.22 9.35,35.89 8.87,36.4 8.87,39.95 10.34,41.61 12.12,41.61 12.76,42.24 I2C.3
N$44
  Top 0.305: IC2.20 19.22,26.48 C12.1
PILOT  (via drill 0.6)  (2 unrouted)
  Top 0.254: R7.2 16.14,35.72 v17.25,36.83
  Top 0.305: R7.2 R1.1
  Top 0.406: 16.18,35.68 R7.2
  Top 0.813: TVS.C 6.04,32.48
  Bottom 0.254: v17.25,36.83 8.87,36.83 7.42,35.38 7.42,32.97 6.53,32.08 5.16,32.03 3.43,30.94
PILOTREAD  (1 unrouted)
  Top 0.254: 16.06,25.48 15.93,25.48 15.93,26.62 15.17,27.38 15.17,29.85 R5.1
  Top 0.305: R7.1 R6.1 R5.1
PP  (via drill 0.6)
  Top 0.254: v28.55,24.64 28.52,24.67 R3.2 28.52,27.12 29.01,27.48 29.8,27.48 30.28,28.09 30.28,28.64 R2.1
  Bottom 0.254: PILOT.1 3.41,34.6 2.19,34.6 1.22,33.63 1.22,24.54 2.14,23.62 5.16,23.62 6.08,22.71 20.65,22.71 21.34,23.39 27.34,23.39 v28.55,24.64
PP_READ  (via drill 0.6)
  Top 0.254: R2.2 26.57,28.83 D6.C 26.34,28.9 v26.34,27.2 | IC2.25 14.29,24.09 v13.44,24.94
  Bottom 0.254: v13.44,24.94 23.3,24.94 23.55,25.15 25.18,26.77 26.27,27.13 v26.34,27.2
PWM  (2 unrouted)
  Top 0.254: 24.44,33.1 24.31,32.97 22.03,32.97 21.65,32.59 21.65,31.19 22.28,30.68 22.31,29.62 23.73,28.47 23.73,26.31 21.52,24.08 21.52,23.06 22.09,22.49 IC2.14 | 24.44,33.22 24.31,33.1
RST  (1 unrouted)
  Top 0.254: R10.1 14.28,28.33 14.28,25.86 15.93,24.21 15.93,21.29 15.55,20.9 IC2.29 | ISP1.5 33.36,40.28 33.08,40.59 33.08,41.48 32.57,41.99 22.28,41.99 21.47,42.8 18.19,42.8 17.4,42.01 17.4,38.51 15.55,36.65 12.55,36.65 10.37,34.47 10.37,31.78 12.78,29.36 12.78,29.01 13.44,28.35 R10.1 | R10.1 14.27,28.39 14.28,28.4
RX-I
  Top 0.254: IC2.30 13.57,20.09 11.31,22.35 11.31,28.58 8.87,30.96 8.87,35.66 7.68,36.91 7.68,38.23 ..4
TX
  Top 0.254: IC2.31 13.48,19.29 10.88,21.95 10.88,28.3 8.44,30.66 8.41,30.68 8.41,35.2 8.11,35.5 8.11,35.51 ..5

### Text on the board
tNames: PP | PLT | GND | _ | _ | H | RELAY | N | H | _ | _
bNames: SCL | SDA | GRN | AC RELAY | AC TEST | AC LINE